# Altium schematic sheet CORE.SchDoc
size A3
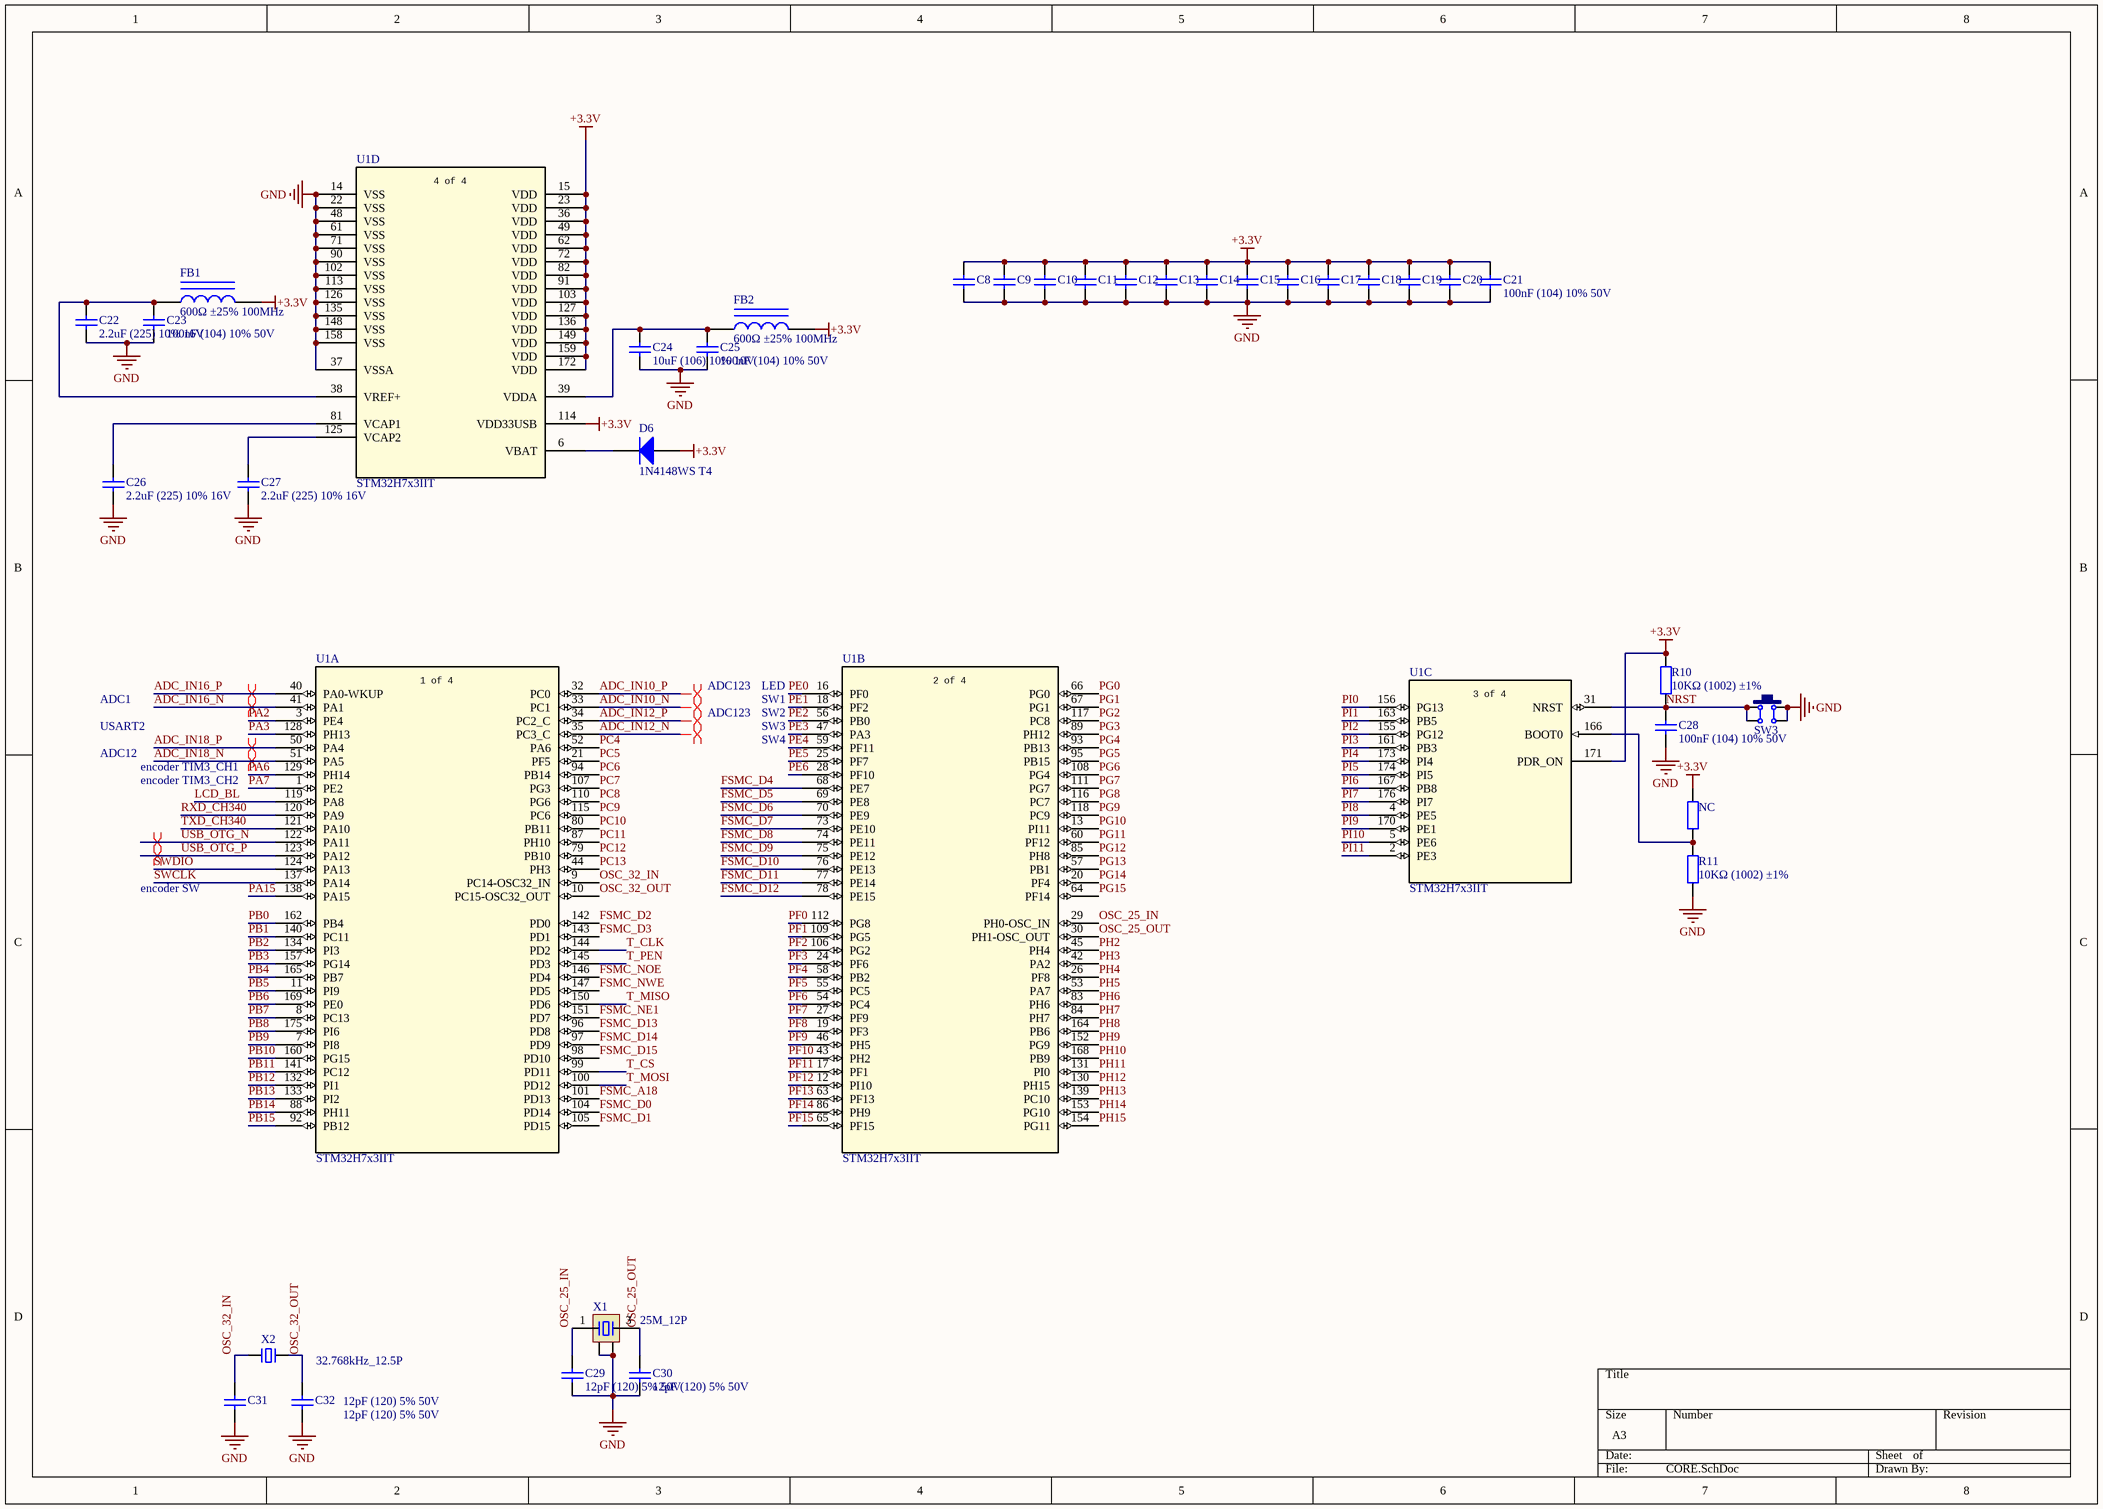
[diagram p0: CORE.SchDoc]

## Parts
C8  100nF (104) 10% 50V  [0603_C]  (value not drawn)
C9  100nF (104) 10% 50V  [0603_C]  (value not drawn)
C10  100nF (104) 10% 50V  [0603_C]  (value not drawn)
C11  100nF (104) 10% 50V  [0603_C]  (value not drawn)
C12  100nF (104) 10% 50V  [0603_C]  (value not drawn)
C13  100nF (104) 10% 50V  [0603_C]  (value not drawn)
C14  100nF (104) 10% 50V  [0603_C]  (value not drawn)
C15  100nF (104) 10% 50V  [0603_C]  (value not drawn)
C16  100nF (104) 10% 50V  [0603_C]  (value not drawn)
C17  100nF (104) 10% 50V  [0603_C]  (value not drawn)
C18  100nF (104) 10% 50V  [0603_C]  (value not drawn)
C19  100nF (104) 10% 50V  [0603_C]  (value not drawn)
C20  100nF (104) 10% 50V  [0603_C]  (value not drawn)
C21  100nF (104) 10% 50V  [0603_C]
C22  2.2uF (225) 10% 16V  [0603_C]
C23  100nF (104) 10% 50V  [0603_C]
C24  10uF (106) 10% 10V  [0603_C]
C25  100nF (104) 10% 50V  [0603_C]
C26  2.2uF (225) 10% 16V  [0603_C]
C27  2.2uF (225) 10% 16V  [0603_C]
C28  100nF (104) 10% 50V  [0603_C]
C29  12pF (120) 5% 50V  [0603_C]
C30  12pF (120) 5% 50V  [0603_C]
C31  12pF (120) 5% 50V  [0603_C]
C32  12pF (120) 5% 50V  [0603_C]
D6  1N4148WS T4  [SOD-323]
FB1  600Ω ±25% 100MHz  [0805_L]
FB2  600Ω ±25% 100MHz  [0805_L]
NC  (no value)  [0603_R]
R10  10KΩ (1002) ±1%  [0603_R]
R11  10KΩ (1002) ±1%  [0603_R]
SW3  6x6x5  [TSW DIP-6*6*6]  (value not drawn)
U1  STM32H7x3IIT  [LQFP176_24x24mm]  (parts A,B,C,D of 4)
X1  25M_12P  [OSC 3225-4P]
X2  32.768kHz_12.5P  [OSC 3215-2P]

## Nets
+3.3V: C8.2 C9.2 C10.2 C11.2 C12.2 C13.2 C14.2 C15.2 C16.2 C17.2 C18.2 C19.2 C20.2 C21.2 D6.1(A) FB1.2 FB2.2 NC.1 R10.2 U1.15(VDD) U1.23(VDD) U1.36(VDD) U1.49(VDD) U1.62(VDD) U1.72(VDD) U1.82(VDD) U1.91(VDD) U1.103(VDD) U1.114(VDD33USB) U1.127(VDD) U1.136(VDD) U1.149(VDD) U1.159(VDD) U1.171(PDR_ON) U1.172(VDD)
GND: C8.1 C9.1 C10.1 C11.1 C12.1 C13.1 C14.1 C15.1 C16.1 C17.1 C18.1 C19.1 C20.1 C21.1 C22.1 C23.1 C24.1 C25.1 C26.1 C27.1 C28.1 C29.1 C30.2 C31.1 C32.1 R11.1 SW3.2 SW3.3 U1.14(VSS) U1.22(VSS) U1.37(VSSA) U1.48(VSS) U1.61(VSS) U1.71(VSS) U1.90(VSS) U1.102(VSS) U1.113(VSS) U1.126(VSS) U1.135(VSS) U1.148(VSS) U1.158(VSS) X1.2 X1.4
ADC_IN10_N: U1.33(PC1)
ADC_IN10_P: U1.32(PC0)
ADC_IN12_N: U1.35(PC3_C)
ADC_IN12_P: U1.34(PC2_C)
ADC_IN16_N: U1.41(PA1)
ADC_IN16_P: U1.40(PA0-WKUP)
ADC_IN18_N: U1.51(PA5)
ADC_IN18_P: U1.50(PA4)
FSMC_A18: U1.101(PD13)
FSMC_D0: U1.104(PD14)
FSMC_D1: U1.105(PD15)
FSMC_D2: U1.142(PD0)
FSMC_D3: U1.143(PD1)
FSMC_D4: U1.68(PE7)
FSMC_D5: U1.69(PE8)
FSMC_D6: U1.70(PE9)
FSMC_D7: U1.73(PE10)
FSMC_D8: U1.74(PE11)
FSMC_D9: U1.75(PE12)
FSMC_D10: U1.76(PE13)
FSMC_D11: U1.77(PE14)
FSMC_D12: U1.78(PE15)
FSMC_D13: U1.96(PD8)
FSMC_D14: U1.97(PD9)
FSMC_D15: U1.98(PD10)
FSMC_NE1: U1.151(PD7)
FSMC_NOE: U1.146(PD4)
FSMC_NWE: U1.147(PD5)
LCD_BL: U1.119(PA8)
NRST: C28.2 R10.1 SW3.1 SW3.4 U1.31(NRST)
OSC_25_IN: C29.2 U1.29(PH0-OSC_IN) X1.1
OSC_25_OUT: C30.1 U1.30(PH1-OSC_OUT) X1.3
OSC_32_IN: C31.2 U1.9(PC14-OSC32_IN) X2.1
OSC_32_OUT: C32.2 U1.10(PC15-OSC32_OUT) X2.2
PA2: U1.3(PE4)
PA3: U1.128(PH13)
PA6: U1.129(PH14)
PA7: U1.1(PE2)
PA15: U1.138(PA15)
PB0: U1.162(PB4)
PB1: U1.140(PC11)
PB2: U1.134(PI3)
PB3: U1.157(PG14)
PB4: U1.165(PB7)
PB5: U1.11(PI9)
PB6: U1.169(PE0)
PB7: U1.8(PC13)
PB8: U1.175(PI6)
PB9: U1.7(PI8)
PB10: U1.160(PG15)
PB11: U1.141(PC12)
PB12: U1.132(PI1)
PB13: U1.133(PI2)
PB14: U1.88(PH11)
PB15: U1.92(PB12)
PC4: U1.52(PA6)
PC5: U1.21(PF5)
PC6: U1.94(PB14)
PC7: U1.107(PG3)
PC8: U1.110(PG6)
PC9: U1.115(PC6)
PC10: U1.80(PB11)
PC11: U1.87(PH10)
PC12: U1.79(PB10)
PC13: U1.44(PH3)
PE0: U1.16(PF0)
PE1: U1.18(PF2)
PE2: U1.56(PB0)
PE3: U1.47(PA3)
PE4: U1.59(PF11)
PE5: U1.25(PF7)
PE6: U1.28(PF10)
PF0: U1.112(PG8)
PF1: U1.109(PG5)
PF2: U1.106(PG2)
PF3: U1.24(PF6)
PF4: U1.58(PB2)
PF5: U1.55(PC5)
PF6: U1.54(PC4)
PF7: U1.27(PF9)
PF8: U1.19(PF3)
PF9: U1.46(PH5)
PF10: U1.43(PH2)
PF11: U1.17(PF1)
PF12: U1.12(PI10)
PF13: U1.63(PF13)
PF14: U1.86(PH9)
PF15: U1.65(PF15)
PG0: U1.66(PG0)
PG1: U1.67(PG1)
PG2: U1.117(PC8)
PG3: U1.89(PH12)
PG4: U1.93(PB13)
PG5: U1.95(PB15)
PG6: U1.108(PG4)
PG7: U1.111(PG7)
PG8: U1.116(PC7)
PG9: U1.118(PC9)
PG10: U1.13(PI11)
PG11: U1.60(PF12)
PG12: U1.85(PH8)
PG13: U1.57(PB1)
PG14: U1.20(PF4)
PG15: U1.64(PF14)
PH2: U1.45(PH4)
PH3: U1.42(PA2)
PH4: U1.26(PF8)
PH5: U1.53(PA7)
PH6: U1.83(PH6)
PH7: U1.84(PH7)
PH8: U1.164(PB6)
PH9: U1.152(PG9)
PH10: U1.168(PB9)
PH11: U1.131(PI0)
PH12: U1.130(PH15)
PH13: U1.139(PC10)
PH14: U1.153(PG10)
PH15: U1.154(PG11)
PI0: U1.156(PG13)
PI1: U1.163(PB5)
PI2: U1.155(PG12)
PI3: U1.161(PB3)
PI4: U1.173(PI4)
PI5: U1.174(PI5)
PI6: U1.167(PB8)
PI7: U1.176(PI7)
PI8: U1.4(PE5)
PI9: U1.170(PE1)
PI10: U1.5(PE6)
PI11: U1.2(PE3)
RXD_CH340: U1.120(PA9)
SWCLK: U1.137(PA14)
SWDIO: U1.124(PA13)
T_CLK: U1.144(PD2)
T_CS: U1.99(PD11)
T_MISO: U1.150(PD6)
T_MOSI: U1.100(PD12)
T_PEN: U1.145(PD3)
TXD_CH340: U1.121(PA10)
USB_OTG_N: U1.122(PA11)
USB_OTG_P: U1.123(PA12)
NetC22_2: C22.2 C23.2 FB1.1 U1.38(VREF+)
NetC24_2: C24.2 C25.2 FB2.1 U1.39(VDDA)
NetC26_2: C26.2 U1.81(VCAP1)
NetC27_2: C27.2 U1.125(VCAP2)
NetD6_2: D6.2(K) U1.6(VBAT)
NetNC_2: NC.2 R11.2 U1.166(BOOT0)

## Layout directives
differential pair: ADC_IN10_N, ADC_IN10_P, ADC_IN12_N, ADC_IN12_P, ADC_IN16_N, ADC_IN16_P, ADC_IN18_N, ADC_IN18_P, USB_OTG_N, USB_OTG_P

## Notes on the sheet
- ADC1
- ADC123
- LED
- SW1
- SW2
- ADC12
- USART2
- encoder TIM3_CH1
- encoder TIM3_CH2
- SW3
- SW4
- encoder SW
- (in symbol STM32H7x3IIT, part A) 1 of 4
- (in symbol STM32H7x3IIT, part B) 2 of 4
- (in symbol STM32H7x3IIT, part C) 3 of 4
- (in symbol STM32H7x3IIT, part D) 4 of 4

## Library data of the parts
C8-C21 C23 C25 C28 = 0603 100nF (104) 10% 50V: 贴片电容; ComponentLink1Description: 供应商链接; ComponentLink1URL: http://www.szlcsc.com/product/details_15331.html; Package: 0603; Supplier: LC; SuppliersPartNumber: C14663
C22 C26 C27 = 0603 2.2uF (225) 10% 16V: 贴片电容; ComponentLink1Description: 供应商链接; ComponentLink1URL: http://www.szlcsc.com/product/details_24366.html; Package: 0603; Supplier: LC; SuppliersPartNumber: C23630
C24 = 0603 10uF (106) 10% 10V: 贴片电容; ComponentLink1Description: 供应商链接; ComponentLink1URL: http://www.szlcsc.com/product/details_20411.html; Package: 0603; Supplier: LC; SuppliersPartNumber: C19702
C29-C32 = 0603 12pF (120) 5% 50V: 贴片电容; ComponentLink1Description: 供应商链接; ComponentLink1URL: http://www.szlcsc.com/product/details_39506.html; Package: 0603; Supplier: LC; SuppliersPartNumber: C38523
D6 = SOD-323 1N4148WS T4: 二极管; ComponentLink1Description: 供应商链接; ComponentLink1URL: http://www.szlcsc.com/product/details_2485.html; Package: SOD-323; Supplier: LC; SuppliersPartNumber: C2128
FB1 FB2 = 0805 600Ω 25% 100MHz: 贴片磁珠; ComponentLink1Description: 供应商链接; ComponentLink1URL: http://www.szlcsc.com/product/details_1369.html; Package: 0805; Supplier: LC; SuppliersPartNumber: C1017
NC = 0603 0Ω (0R0) 1%: 贴片电阻; ComponentLink1Description: 供应商链接; ComponentLink1URL: http://www.szlcsc.com/product/details_21903.html; Package: 0603; Supplier: LC; SuppliersPartNumber: C21189
R10 R11 = 0603 10KΩ (1002) 1%: 贴片电阻; ComponentLink1Description: 供应商链接; ComponentLink1URL: http://www.szlcsc.com/product/details_26547.html; Package: 0603; Supplier: LC; SuppliersPartNumber: C25804
SW3 = TSW DIP-6x6: 直插6x6轻触开关; 版权归属: 源创客; BOM名称: 直插6x6轻触开关; 学习资源: www.ooocke.com
U1 = STM32H7x3IIT: Imported; Vendor: STMicroelectronics; Copyright: Copyright (C) 2016 Accelerated Designs. All rights reserved; Manufacturer_Part_Number: stm32h7x3iit; Value: Value; Type: Type; RefDes: RefDes
X1 = XTAL-4P: 4脚无源晶振; 版权归属: 源创客; BOM名称: 4脚无源晶振; 学习资源: www.ooocke.com
X2 = XTAL-2P: 2脚无源脚晶振; 版权归属: 源创客; BOM名称: 2脚无源脚晶振; 学习资源: www.ooocke.com